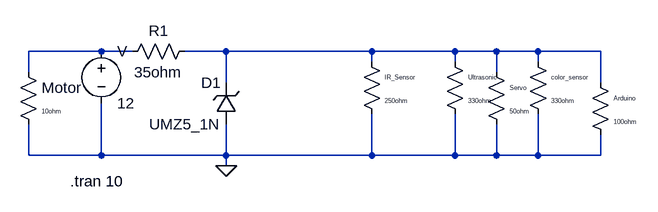
[diagram p0: schematic Updated_LT_Spice.asc]
Updated_LT_Spice.asc, the LTspice schematic file:
Version 4.1
SHEET 1 884 680
WIRE 0 48 -112 48
WIRE 48 48 0 48
WIRE 192 48 128 48
WIRE 416 48 192 48
WIRE 544 48 416 48
WIRE 608 48 544 48
WIRE 672 48 608 48
WIRE 768 48 672 48
WIRE 416 64 416 48
WIRE 544 64 544 48
WIRE 672 64 672 48
WIRE -112 80 -112 48
WIRE 608 80 608 48
WIRE 192 96 192 48
WIRE 768 96 768 48
WIRE -112 208 -112 160
WIRE 0 208 0 128
WIRE 0 208 -112 208
WIRE 192 208 192 160
WIRE 192 208 0 208
WIRE 416 208 416 144
WIRE 416 208 192 208
WIRE 544 208 544 144
WIRE 544 208 416 208
WIRE 608 208 608 160
WIRE 608 208 544 208
WIRE 672 208 672 144
WIRE 672 208 608 208
WIRE 768 208 768 176
WIRE 768 208 672 208
WIRE 192 224 192 208
FLAG 192 224 0
SYMBOL voltage 0 32 R0
SYMATTR InstName V
SYMATTR Value 12
SYMBOL res 144 32 R90
WINDOW 0 0 56 VBottom 2
WINDOW 3 32 56 VTop 2
SYMATTR InstName R1
SYMATTR Value 35ohm
SYMBOL zener 208 160 R180
WINDOW 0 24 64 Left 2
WINDOW 3 24 0 Left 2
SYMATTR InstName D1
SYMATTR Value UMZ5_1N
SYMBOL res 400 48 R0
WINDOW 0 36 40 Left 0
WINDOW 3 36 76 Left 0
SYMATTR InstName IR_Sensor
SYMATTR Value 250ohm
SYMBOL res 528 48 R0
WINDOW 0 36 40 Left 0
WINDOW 3 36 76 Left 0
SYMATTR InstName Ultrasonic
SYMATTR Value 330ohm
SYMBOL res 592 64 R0
WINDOW 0 36 40 Left 0
WINDOW 3 36 76 Left 0
SYMATTR InstName Servo
SYMATTR Value 50ohm
SYMBOL res 656 48 R0
WINDOW 0 36 40 Left 0
WINDOW 3 36 76 Left 0
SYMATTR InstName color_sensor
SYMATTR Value 330ohm
SYMBOL res 752 80 R0
WINDOW 0 36 40 Left 0
WINDOW 3 36 76 Left 0
SYMATTR InstName Arduino
SYMATTR Value 100ohm
SYMBOL res -128 64 R0
WINDOW 3 36 76 Left 0
SYMATTR InstName Motor
SYMATTR Value 10ohm
TEXT -48 248 Left 2 !.tran 10

The netlist it stands for:
* Updated_LT_Spice.asc
V N001 0 12
R1 N002 N001 35ohm
D1 0 N002 UMZ5_1N
R§IR_Sensor N002 0 250ohm
R§Ultrasonic N002 0 330ohm
R§Servo N002 0 50ohm
R§color_sensor N002 0 330ohm
R§Arduino N002 0 100ohm
R§Motor N001 0 10ohm
.model D D
.lib standard.dio
.tran 10
.backanno
.end